# Altium schematic sheet WIO_E5.SchDoc
size A4; SheetNumber: 2; SheetTotal: 3
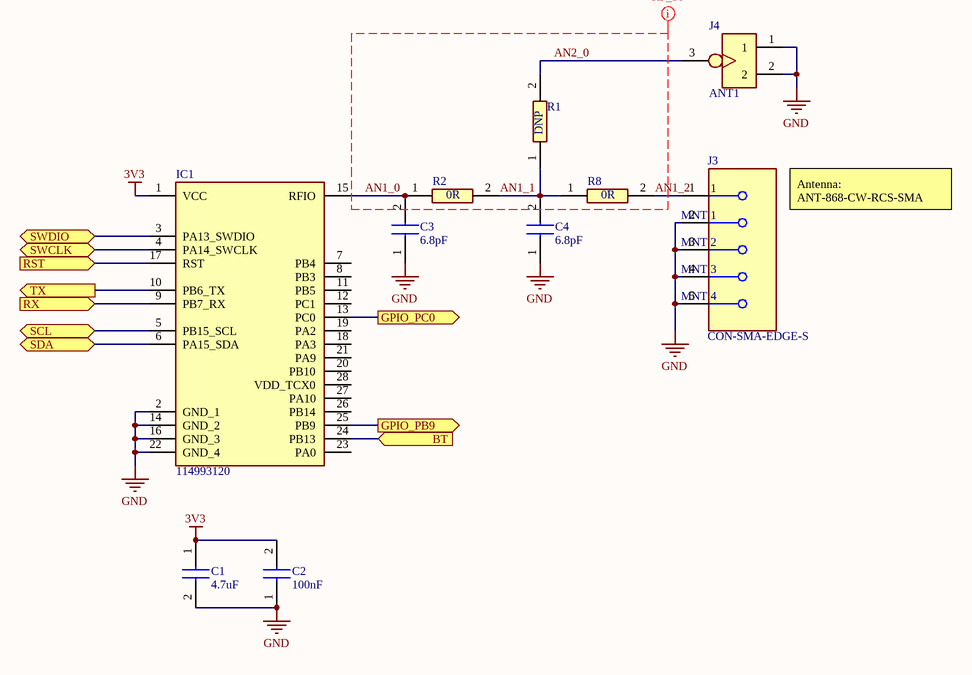
[diagram p0: WIO_E5.SchDoc]

## Parts
C1  4.7uF  [CAPC1608X90N]
C2  100nF  [CAPC1005X70N]
C3  6.8pF  [GCM155]
C4  6.8pF  [GCM155]
IC1  114993120  [114993120]
J3  CON-SMA-EDGE-S  [FP-CON-SMA-EDGE-S-MFG]
J4  ANT1  [RECE.20279.001E.01]
R1  DNP  [RESC1005X40N]
R2  0R  [RESC1005X40N]
R8  0R  [RESC1005X40N]

## Ports
BT (in, see main[2B]), GPIO_PB9 (out, see main[2B]), GPIO_PC0 (out, see main[2B]), RST (in, see main[2B]), RX (in, see main[2B]), SCL (bidir, see main[2B], EEPROM_ID[3B]), SDA (bidir, see main[2B], EEPROM_ID[3B]), SWCLK (bidir, see main[2B]), SWDIO (bidir, see main[2B]), TX (out, see main[2B])

## Nets
3V3: C1.1 C2.2 IC1.1(VCC)
GND: C1.2 C2.1 C3.1 C4.1 IC1.2(GND_1) IC1.14(GND_2) IC1.16(GND_3) IC1.22(GND_4) J3.2(MNT_1) J3.3(MNT_2) J3.4(MNT_3) J3.5(MNT_4) J4.1 J4.2
AN1_0: C3.2 IC1.15(RFIO) R2.1
AN1_1: C4.2 R1.1 R2.2 R8.1
AN1_2: J3.1 R8.2
AN2_0: J4.3 R1.2
BT: IC1.24(PB13) ; port BT
GPIO_PB9: IC1.25(PB9) ; port GPIO_PB9
GPIO_PC0: IC1.13(PC0) ; port GPIO_PC0
RST: IC1.17(RST) ; port RST
RX: IC1.9(PB7_RX) ; port RX
SCL: IC1.5(PB15_SCL) ; port SCL
SDA: IC1.6(PA15_SDA) ; port SDA
SWCLK: IC1.4(PA14_SWCLK) ; port SWCLK
SWDIO: IC1.3(PA13_SWDIO) ; port SWDIO
TX: IC1.10(PB6_TX) ; port TX

Not connected (* = marked no-connect by the designer): IC1 7(PB4) 8(PB3) 11(PB5) 12(PC1) 18(PA3) 19(PA2) 20(PB10) 21(PA9) 23(PA0) 26(PB14) 27(PA10) 28(VDD_TCX0)

## Layout directives
net class RF_50: AN1_0, AN1_1, AN1_2, AN2_0

## Notes on the sheet
- Antenna:
  ANT-868-CW-RCS-SMA
- Title:
- Date:
- Project:
- Type:
- Schematic
- Variant:
- Revision:
- Sheet
- of
- Author:
- Evžen Šteif
- Size:
- A4

## Library data of the parts
C1 = GRM188R61E475KE11J: Capacitor; Manufacturer_Name: Murata Electronics; Datasheet Link: https://search.murata.co.jp/Ceramy/image/img/A01X/G101/ENG/GRM188R61E475KE11-01A.pdf; Height: 0.9mm; Manufacturer_Part_Number: GRM188R61E475KE11J; Mouser Part Number: 81-GRM188R61E475KE1J; Mouser Price/Stock: https://www.mouser.co.uk/ProductDetail/Murata-Electronics/GRM188R61E475KE11J?qs=hNud%2FORuBR3%2Fa9GLJFT8KA%3D%3D; Arrow Part Number: GRM188R61E475KE11J; Arrow Price/Stock: https://www.arrow.com/en/products/grm188r61e475ke11j/murata-manufacturing
C2 = GRM155R61A104KA01D: Capacitor; Manufacturer_Name: Murata Electronics; Datasheet Link: https://search.murata.co.jp/Ceramy/image/img/A01X/G101/ENG/GRM155R61A104KA01-02A.pdf; Height: 0.7mm; Manufacturer_Part_Number: GRM155R61A104KA01D; Mouser Part Number: 81-GRM155R61A104KA01; Mouser Price/Stock: https://www.mouser.co.uk/ProductDetail/Murata-Electronics/GRM155R61A104KA01D?qs=5bAuhL3RhmNZw0v59AqOJA%3D%3D; Arrow Part Number: GRM155R61A104KA01D; Arrow Price/Stock: https://www.arrow.com/en/products/grm155r61a104ka01d/murata-manufacturing?utm_currency=USD&region=europe
C3 C4 = GCM1555C1H6R8BA16J: Capacitor; Manufacturer_Name: Murata Electronics; Datasheet Link: https://search.murata.co.jp/Ceramy/image/img/A01X/G101/ENG/GCM1555C1H6R8BA16-01A.pdf; Height: 0.55mm; Manufacturer_Part_Number: GCM1555C1H6R8BA16J; Mouser Part Number: 81-GCM1555C1H6R8BA6J; Mouser Price/Stock: https://www.mouser.co.uk/ProductDetail/Murata-Electronics/GCM1555C1H6R8BA16J?qs=QzBtWTOodeUHvskaC%252BV70A%3D%3D
IC1 = 114993120: Integrated Circuit; Manufacturer_Name: Seeed Studio; Datasheet Link: https://files.seeedstudio.com/products/114993120/Wio-E5-LE%20module%20datasheet_v1.0.pdf; Height: 2.7mm; Manufacturer_Part_Number: 114993120; Mouser Part Number: 713-114993120; Mouser Price/Stock: https://www.mouser.co.uk/ProductDetail/Seeed-Studio/114993120?qs=QpmGXVUTftHkewPVPDVW5g%3D%3D; Arrow Part Number: 114993120; Arrow Price/Stock: https://www.arrow.com/en/products/114993120/seeed-technology-limited?utm_currency=USD&region=nac
J3 = CMP-204357-000001-1: CONN SMA JACK STR EDGE MNT; Manufacturer: RF Solutions Ltd.; Impedance: 50Ω; Conn Orientation: Right Angle; Is Female: yes; Number Of Contacts: 1; Frequency: 18GHz; Shielding: true; Category: Conn; ComponentLink2URL: https://www.rfsolutions.co.uk/downloads/1498648656DS-CON-EDGE-SMA-4.pdf; Octopart: https://octopart.com/con-sma-edge-s-rf+solutions-70967450; Package: CONN_JACK; Manufacturer Part Number: CON-SMA-EDGE-S; Height: 6.35mm; Device Class L1: Connectors; Footprint Url: https://forum.upverter.com/uploads/default/original/3X/b/e/be75b907af57498775929d6d9099689c472e0307.pdf; Contact Material: Gold; ComponentLink2Description: Datasheet; Device Class L2: RF / Coaxial Connectors; RoHS: TRUE; Device Class L3: unset; Digikey Description: CONN SMA JACK STR EDGE MNT; Lead Free: Yes; Automotive: No
J4 = RECE-20279-001E-01: Connector; Manufacturer_Name: Taoglas; Manufacturer_Part_Number: RECE-20279-001E-01; Mouser Part Number: N/A; Mouser Price/Stock: https://www.mouser.co.uk/ProductDetail/Taoglas/RECE-20279-001E-01?qs=WUa1z%2FNV9%252B3mVij1vDlP0A%3D%3D
R1 R2 R8 = RCA04020000ZSED: Resistor; Manufacturer_Name: Vishay; Datasheet Link: https://componentsearchengine.com/Datasheets/2/RCA04020000ZSED.pdf; Height: 0.4mm; Manufacturer_Part_Number: RCA04020000ZSED; Mouser Part Number: 71-RCA04020000ZSED; Mouser Price/Stock: https://www.mouser.co.uk/ProductDetail/Vishay-Draloric/RCA04020000ZSED?qs=gk21WLQFtgRTmhk63km%2F1w%3D%3D; Arrow Part Number: RCA04020000ZSED; Arrow Price/Stock: https://www.arrow.com/en/products/rca04020000zsed/vishay?utm_currency=USD&region=nac